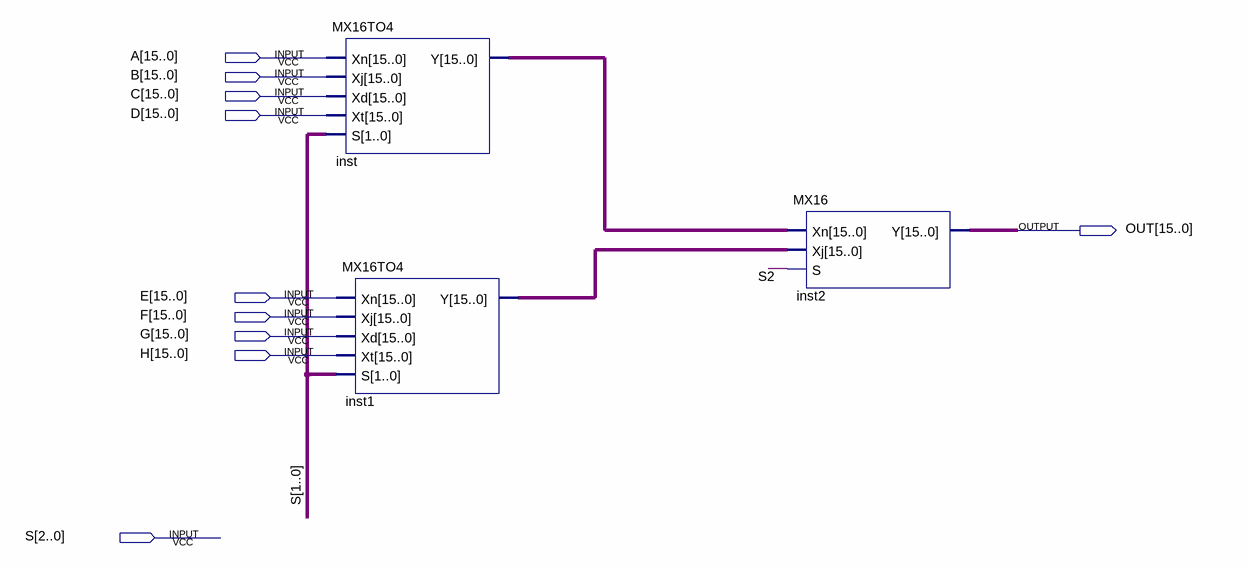
[diagram p0: schematic sheet]
// Quartus schematic MX16TO8.bdf as structural Verilog: 3 symbols, 10 pins
module MX16TO8 (
  input  [15:0] A,
  input  [15:0] B,
  input  [15:0] C,
  input  [15:0] D,
  input  [15:0] E,
  input  [15:0] F,
  input  [15:0] G,
  input  [15:0] H,
  input  [2:0] S,
  output [15:0] OUT
);

  wire [15:0] inst1_y, inst_y;

  MX16TO4 inst (.Xn(A), .Xj(B), .Xd(C), .Xt(D), .S(S[1:0]), .Y(inst_y));
  MX16TO4 inst1 (.Xn(E), .Xj(F), .Xd(G), .Xt(H), .S(S[1:0]), .Y(inst1_y));
  MX16 inst2 (.Xn(inst_y), .Xj(inst1_y), .S(S[2]), .Y(OUT));
endmodule
